# Altium schematic sheet 0084 - Connectors.SchDoc: 0084 - AR Display Board
size Tabloid; Date: 3/18/2018; DrawnBy: Ryan Young; DocumentNumber: 1; Revision: 2.1; SheetNumber: 3; SheetTotal: 3; SheetTitle: Connectors; PageSetup: Record=PageOptions|CenterHorizontal=True|CenterVertical=True|PrintScale=0.95|XCorrection=1.00|YCorrection=1.00|PrintKind=0|BorderSize=5000000|LeftOffset=0|BottomOffset=0|Orientation=2|PaperLength=1000|PaperWidth=1000|Scale=100|PaperSource=15|PrintQuality=600|MediaType=1|DitherType=10|PaperKind=Letter (8.5 x 11")|PrintScaleMode=1; Time: 3/18/2018
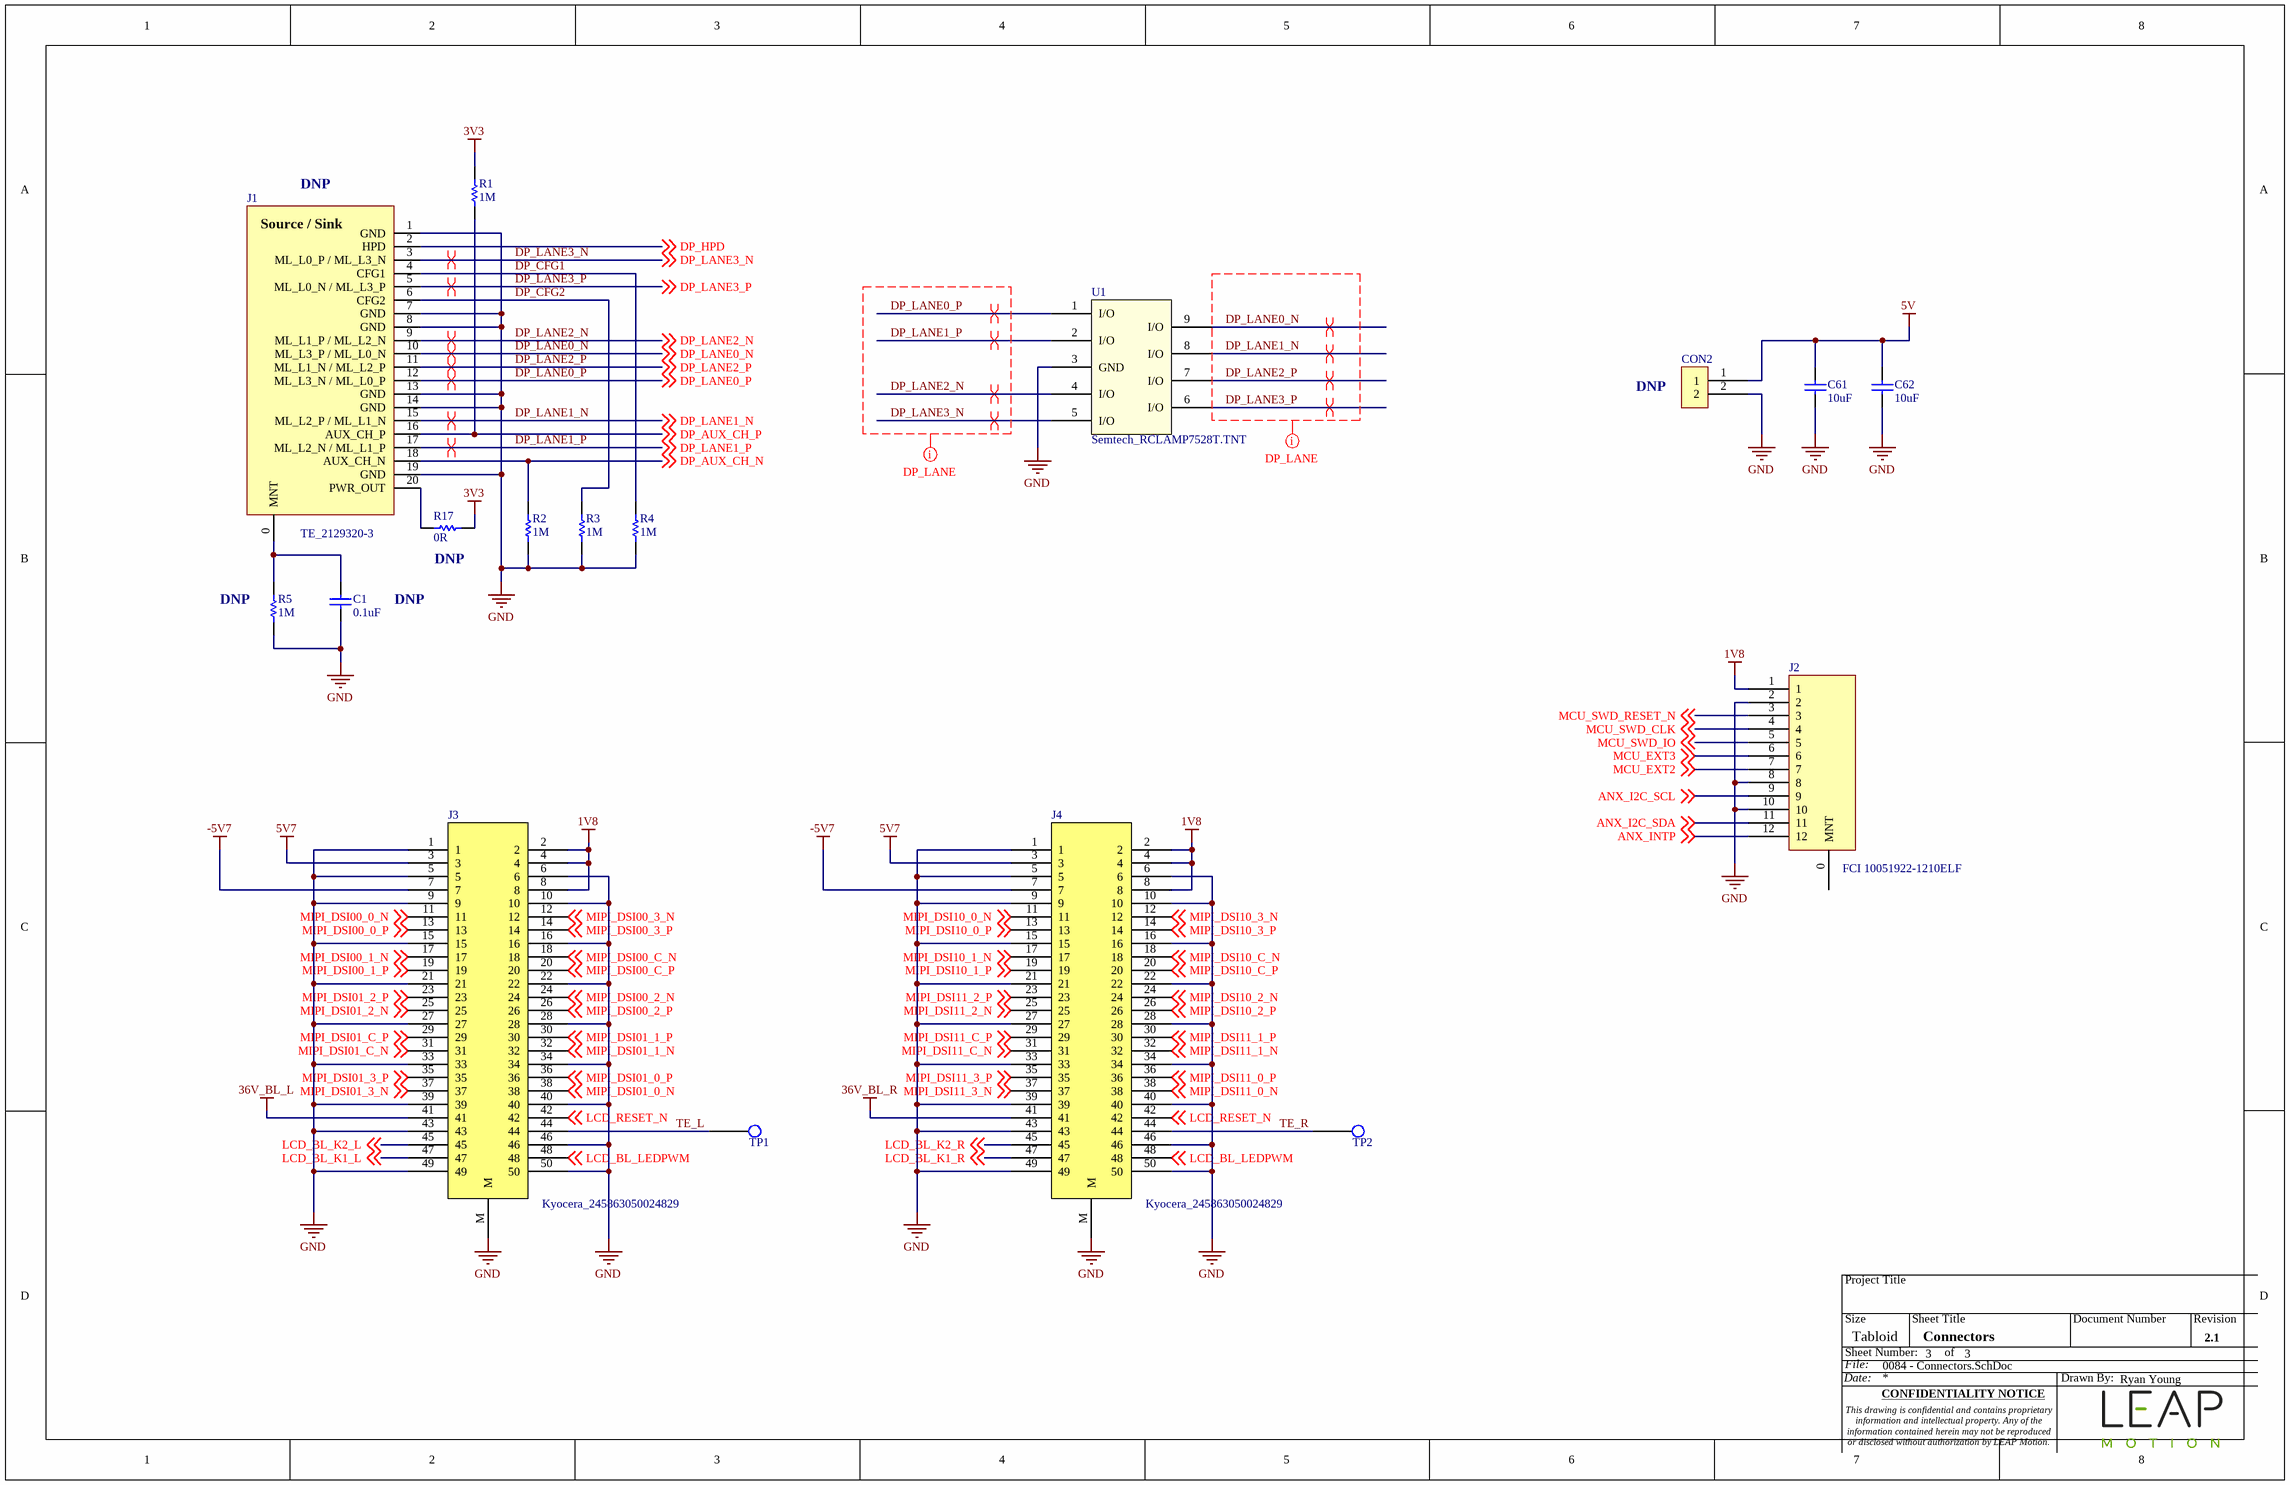
[diagram p0: 0084 - Connectors.SchDoc]

## Parts
C1  0.1uF  [CAPC0201(0603)33_N]  (no BOM)
C61  10uF  [CAPC1206(3216)170_N]
C62  10uF  [CAPC1206(3216)170_N]
CON2  CON2  [CON2_100mil]  (value not drawn)  (no BOM)
J1  TE_2129320-3  [TE_2129320-3]  (no BOM)
J2  FCI 10051922-1210ELF  [FCI 10051922-1210ELF]
J3  Kyocera_245863050024829  [Kyocera_245863050024829]
J4  Kyocera_245863050024829  [Kyocera_245863050024829]
R1  1M  [RESC0201(0603)_N]
R2  1M  [RESC0201(0603)_N]
R3  1M  [RESC0201(0603)_N]
R4  1M  [RESC0201(0603)_N]
R5  1M  [RESC0201(0603)_N]  (no BOM)
R17  0R  [RESC0402(1005)_N]  (no BOM)
TP1  TestPoint  [TestPointRnd-1_5mm]  (value not drawn)  (no BOM)
TP2  TestPoint  [TestPointRnd-1_5mm]  (value not drawn)  (no BOM)
U1  Semtech_RCLAMP7528T.TNT  [Semtech_RCLAMP7528T.TNT]

## Nets
1V8: J2.1 J3.2 J3.4 J3.8 J4.2 J4.4 J4.8
3V3: R1.2 R17.2
5V: C61.2 C62.2 CON2.1
5V7: J3.3 J4.3
36V_BL_L: J3.41
36V_BL_R: J4.41
-5V7: J3.7 J4.7
GND: C1.1 C61.1 C62.1 CON2.2 J1.1(GND) J1.7(GND) J1.8(GND) J1.13(GND) J1.14(GND) J1.19(GND) J2.2 J2.8 J2.10 J3.1 J3.5 J3.6 J3.9 J3.10 J3.15 J3.16 J3.21 J3.22 J3.27 J3.28 J3.33 J3.34 J3.39 J3.40 J3.43 J3.46 J3.49 J3.50 J3.M J4.1 J4.5 J4.6 J4.9 J4.10 J4.15 J4.16 J4.21 J4.22 J4.27 J4.28 J4.33 J4.34 J4.39 J4.40 J4.43 J4.46 J4.49 J4.50 J4.M R2.1 R3.1 R4.1 R5.1 U1.3(GND)
ANX_I2C_SCL: J2.9 ; off-sheet ANX_I2C_SCL
ANX_I2C_SDA: J2.11 ; off-sheet ANX_I2C_SDA
ANX_INTP: J2.12 ; off-sheet ANX_INTP
DP_AUX_CH_N: J1.18(AUX_CH_N) R2.2 ; off-sheet DP_AUX_CH_N
DP_AUX_CH_P: J1.16(AUX_CH_P) R1.1 ; off-sheet DP_AUX_CH_P
DP_CFG1: J1.4(CFG1) R4.2
DP_CFG2: J1.6(CFG2) R3.2
DP_HPD: J1.2(HPD) ; off-sheet DP_HPD
DP_LANE0_N: J1.10(ML_L3_P_/_ML_L0_N) U1.9(I/O) ; off-sheet DP_LANE0_N
DP_LANE0_P: J1.12(ML_L3_N_/_ML_L0_P) U1.1(I/O) ; off-sheet DP_LANE0_P
DP_LANE1_N: J1.15(ML_L2_P_/_ML_L1_N) U1.8(I/O) ; off-sheet DP_LANE1_N
DP_LANE1_P: J1.17(ML_L2_N_/_ML_L1_P) U1.2(I/O) ; off-sheet DP_LANE1_P
DP_LANE2_N: J1.9(ML_L1_P_/_ML_L2_N) U1.4(I/O) ; off-sheet DP_LANE2_N
DP_LANE2_P: J1.11(ML_L1_N_/_ML_L2_P) U1.7(I/O) ; off-sheet DP_LANE2_P
DP_LANE3_N: J1.3(ML_L0_P_/_ML_L3_N) U1.5(I/O) ; off-sheet DP_LANE3_N
DP_LANE3_P: J1.5(ML_L0_N_/_ML_L3_P) U1.6(I/O) ; off-sheet DP_LANE3_P
LCD_BL_K1_L: J3.47 ; off-sheet LCD_BL_K1_L
LCD_BL_K1_R: J4.47 ; off-sheet LCD_BL_K1_R
LCD_BL_K2_L: J3.45 ; off-sheet LCD_BL_K2_L
LCD_BL_K2_R: J4.45 ; off-sheet LCD_BL_K2_R
LCD_BL_LEDPWM: J3.48 J4.48 ; off-sheet LCD_BL_LEDPWM
LCD_RESET_N: J3.42 J4.42 ; off-sheet LCD_RESET_N
MCU_EXT2: J2.7 ; off-sheet MCU_EXT2
MCU_EXT3: J2.6 ; off-sheet MCU_EXT3
MCU_SWD_CLK: J2.4 ; off-sheet MCU_SWD_CLK
MCU_SWD_IO: J2.5 ; off-sheet MCU_SWD_IO
MCU_SWD_RESET_N: J2.3 ; off-sheet MCU_SWD_RESET_N
MIPI_DSI00_0_N: J3.11 ; off-sheet MIPI_DSI00_0_N
MIPI_DSI00_0_P: J3.13 ; off-sheet MIPI_DSI00_0_P
MIPI_DSI00_1_N: J3.17 ; off-sheet MIPI_DSI00_1_N
MIPI_DSI00_1_P: J3.19 ; off-sheet MIPI_DSI00_1_P
MIPI_DSI00_2_N: J3.24 ; off-sheet MIPI_DSI00_2_N
MIPI_DSI00_2_P: J3.26 ; off-sheet MIPI_DSI00_2_P
MIPI_DSI00_3_N: J3.12 ; off-sheet MIPI_DSI00_3_N
MIPI_DSI00_3_P: J3.14 ; off-sheet MIPI_DSI00_3_P
MIPI_DSI00_C_N: J3.18 ; off-sheet MIPI_DSI00_C_N
MIPI_DSI00_C_P: J3.20 ; off-sheet MIPI_DSI00_C_P
MIPI_DSI01_0_N: J3.38 ; off-sheet MIPI_DSI01_0_N
MIPI_DSI01_0_P: J3.36 ; off-sheet MIPI_DSI01_0_P
MIPI_DSI01_1_N: J3.32 ; off-sheet MIPI_DSI01_1_N
MIPI_DSI01_1_P: J3.30 ; off-sheet MIPI_DSI01_1_P
MIPI_DSI01_2_N: J3.25 ; off-sheet MIPI_DSI01_2_N
MIPI_DSI01_2_P: J3.23 ; off-sheet MIPI_DSI01_2_P
MIPI_DSI01_3_N: J3.37 ; off-sheet MIPI_DSI01_3_N
MIPI_DSI01_3_P: J3.35 ; off-sheet MIPI_DSI01_3_P
MIPI_DSI01_C_N: J3.31 ; off-sheet MIPI_DSI01_C_N
MIPI_DSI01_C_P: J3.29 ; off-sheet MIPI_DSI01_C_P
MIPI_DSI10_0_N: J4.11 ; off-sheet MIPI_DSI10_0_N
MIPI_DSI10_0_P: J4.13 ; off-sheet MIPI_DSI10_0_P
MIPI_DSI10_1_N: J4.17 ; off-sheet MIPI_DSI10_1_N
MIPI_DSI10_1_P: J4.19 ; off-sheet MIPI_DSI10_1_P
MIPI_DSI10_2_N: J4.24 ; off-sheet MIPI_DSI10_2_N
MIPI_DSI10_2_P: J4.26 ; off-sheet MIPI_DSI10_2_P
MIPI_DSI10_3_N: J4.12 ; off-sheet MIPI_DSI10_3_N
MIPI_DSI10_3_P: J4.14 ; off-sheet MIPI_DSI10_3_P
MIPI_DSI10_C_N: J4.18 ; off-sheet MIPI_DSI10_C_N
MIPI_DSI10_C_P: J4.20 ; off-sheet MIPI_DSI10_C_P
MIPI_DSI11_0_N: J4.38 ; off-sheet MIPI_DSI11_0_N
MIPI_DSI11_0_P: J4.36 ; off-sheet MIPI_DSI11_0_P
MIPI_DSI11_1_N: J4.32 ; off-sheet MIPI_DSI11_1_N
MIPI_DSI11_1_P: J4.30 ; off-sheet MIPI_DSI11_1_P
MIPI_DSI11_2_N: J4.25 ; off-sheet MIPI_DSI11_2_N
MIPI_DSI11_2_P: J4.23 ; off-sheet MIPI_DSI11_2_P
MIPI_DSI11_3_N: J4.37 ; off-sheet MIPI_DSI11_3_N
MIPI_DSI11_3_P: J4.35 ; off-sheet MIPI_DSI11_3_P
MIPI_DSI11_C_N: J4.31 ; off-sheet MIPI_DSI11_C_N
MIPI_DSI11_C_P: J4.29 ; off-sheet MIPI_DSI11_C_P
TE_L: J3.44 TP1.0
TE_R: J4.44 TP2.0
NetC1_2: C1.2 J1.0(MNT) R5.2
NetJ1_20: J1.20(PWR_OUT) R17.1

Not connected (* = marked no-connect by the designer): J2 0(MNT)

## Layout directives
differential pair: DP_LANE0_N, DP_LANE0_P, DP_LANE1_N, DP_LANE1_P, DP_LANE2_N, DP_LANE2_P, DP_LANE3_N, DP_LANE3_P
net class DP_LANE: DP_LANE0_N, DP_LANE0_P, DP_LANE1_N, DP_LANE1_P, DP_LANE2_N, DP_LANE2_P, DP_LANE3_N, DP_LANE3_P

## Notes on the sheet
- (near J1) DNP
- (near CON2) DNP
- (near R17) DNP
- (near R5) DNP
- DNP
- Project Title
- Size
- Sheet Number:
- File:
- Tabloid
- Sheet Title
- of
- Document Number
- Revision
- Date:
- CONFIDENTIALITY NOTICE
- Drawn By:
- This drawing is confidential and contains proprietary information and intellectual property. Any of the information contained herein may not be reproduced or disclosed without authorization by LEAP Motion.
- (in symbol CONN_0094) Source / Sink

## Library data of the parts
C1 = CAP_0060: Capacitor, 0.1uF, 10V, 10%, 0201, Ceramic, X5R; Manufacturer: Murata; Manufacturer P/N: GRM033R61A104KE15D; Polarity: No; Temp Range: -55C - 85C; P/N: CAP_0060; Display: 0.1uF, 10V; Value: 0.1uF; Tolerance: 10%; Voltage Rating: 10V; Dielectric: X5R; Material: Ceramic; Package: 0201; Max Height: 0.15mm; RoHS: True; Supplier: Mouser; Supplier P/N: 581-81-GRM033R61A104KE5D; Supplier Price: 0.1; Datasheet: http://www.mouser.com/ds/2/281/c02e-2905.pdf; Date: 6/29/2016; Author: AA
C61 C62 = CAP_0068: Capacitor, 10uF, 50V, 10%, 1206, Ceramic, X7R; Manufacturer: Samsung; Manufacturer P/N: CL31B106KBHNNNE; Polarity: No; Temp Range: -55C - 125C; P/N: CAP_0068; Display: 10uF, 50V; Value: 10uF; Tolerance: 10%; Voltage Rating: 50V; Dielectric: X7R; Material: Ceramic; Package: 1206; Max Height: 1.8mm; RoHS: True; Supplier: Digikey; Supplier P/N: 1276-6767-1-ND; Supplier Price: 0.33; Datasheet: https://media.digikey.com/pdf/Data%20Sheets/Samsung%20PDFs/CL_Series_MLCC_ds.pdf; Date: 7/19/2017; Author: RY
CON2 = CONN_0036: Connector, Generic, Header, 2POS, 2.54mm; Display Value: Generic Generic; Rows: 1; P/N: CONN_0036; Manufacturer: Generic; Manufacturer P/N: Generic; Type: Generic; Direction: Header; Mounting Height: Generic; Pins: 2; Mounting Type: TH; RoHS: False; Date: 2/28/2014; Author: JDS; Pitch: 2.54mm
J1 = CONN_0094: Connector, TE Connectivity, Receptacle, 20POS, 0.9mm; Display Value: TE Connectivity 2129320-3; Mounting Height: 4.17mm; Temp Range: -40 - 85C; Rows: 2; P/N: CONN_0094; Manufacturer: TE Connectivity; Manufacturer P/N: 2129320-3; Type: Mini DisplayPort; Direction: Receptacle; Pins: 20; Mounting Type: SMD; RoHS: True; Supplier: Digikey; Supplier P/N: A120537CT-ND; Supplier Price: 2.36; Datasheet: http://www.te.com/commerce/DocumentDelivery/DDEController?Action=srchrtrv&DocNm=2129320&DocType=Customer+Drawing&DocLang=English; Date: 7/17/2017; Author: RY; Pitch: 0.9mm
J2 = CONN_0043: Connector, FCI, Right Angle, 12POS, 0.5mm; Mounting Height: 1.3mm; Temp Range: -55C - 85C; Rows: 1; P/N: CONN_0043; Display Value: FCI 10051922-1210ELF; Manufacturer: FCI; Manufacturer P/N: 10051922-1210ELF; Type: FPC; Direction: Right Angle; Pins: 12; Mounting Type: SMD; RoHS: True; Supplier: Digikey; Supplier P/N: 609-1236-6-ND; Supplier Price: 0.53; Datasheet: http://portal.fciconnect.com/Comergent//fci/drawing/10051922.pdf; Date: 6/3/2014; Author: NR; Pitch: 0.5mm
J3 J4 = Kyocera_245863050024829: 245863050024829; Manufacturer: Kyocera; Manufacturer P/N: 245863050024829
R1-R5 = RES_0178: Resistor, 1M, 1/20W, 1%, 0201; Manufacturer: Panasonic Electronic Components; Manufacturer P/N: ERJ-1GEF1004C; Display Value: 1M, 0201; Temp Range: -55C - 125C; P/N: RES_0178; Value: 1M; Tolerance: 1%; Power Rating: 1/20W; Package: 0201; Max Height: 0.26mm; RoHS: True; Supplier: Digikey; Supplier P/N: P1.00MABCT-ND; Supplier Price: 0.1; Datasheet: https://media.digikey.com/pdf/Data%20Sheets/Panasonic%20Resistors%20Thermistors%20PDFs/ERJ_G,R,E_Rev08.pdf; Date: 7/20/2017; Author: RY
R17 = RES_0006: Resistor, 0R, 1/10W, Jumper, 0402; Manufacturer: Panasonic Electronic Components; Manufacturer P/N: ERJ-2GE0R00X; Display Value: 0R, 0402; Temp Range: -55C - 155C; P/N: RES_0006; Value: 0R; Tolerance: Jumper; Power Rating: 1/10W; Package: 0402; Max Height: 0.40mm; RoHS: True; Supplier: Digikey; Supplier P/N: P0.0JCT-ND; Supplier Price: 0.05; Datasheet: http://industrial.panasonic.com/www-data/pdf/AOA0000/AOA0000CE1.pdf; Date: 2/21/2013; Author: NR
TP1 TP2 = MISC_0052: Misc, TestPoint; P/N: MISC_0052; Display: TestPoint; Class: Misc; Manufacturer: TestPoint; Manufacturer P/N: TestPointRnd-1_5mm; RoHS: False; Date: 6/29/2017; Author: RY
U1 = IC_0201: TVS DIODE 5VWM 15VC SLP2611N9T; P/N: IC_0201; Manufacturer: Semtech; Manufacturer P/N: RCLAMP7528T.TNT; Package: XFDFN-9; Operating Temp Range: -55C - 125C; Supplier: Digikey; Supplier P/N: RCLAMP7528T.TNTCT-ND; Supplier Price: 1.37; Datasheet: http://www.semtech.com/images/datasheet/rclamp7528t.pdf; Date: 7/25/2017; Author: RY